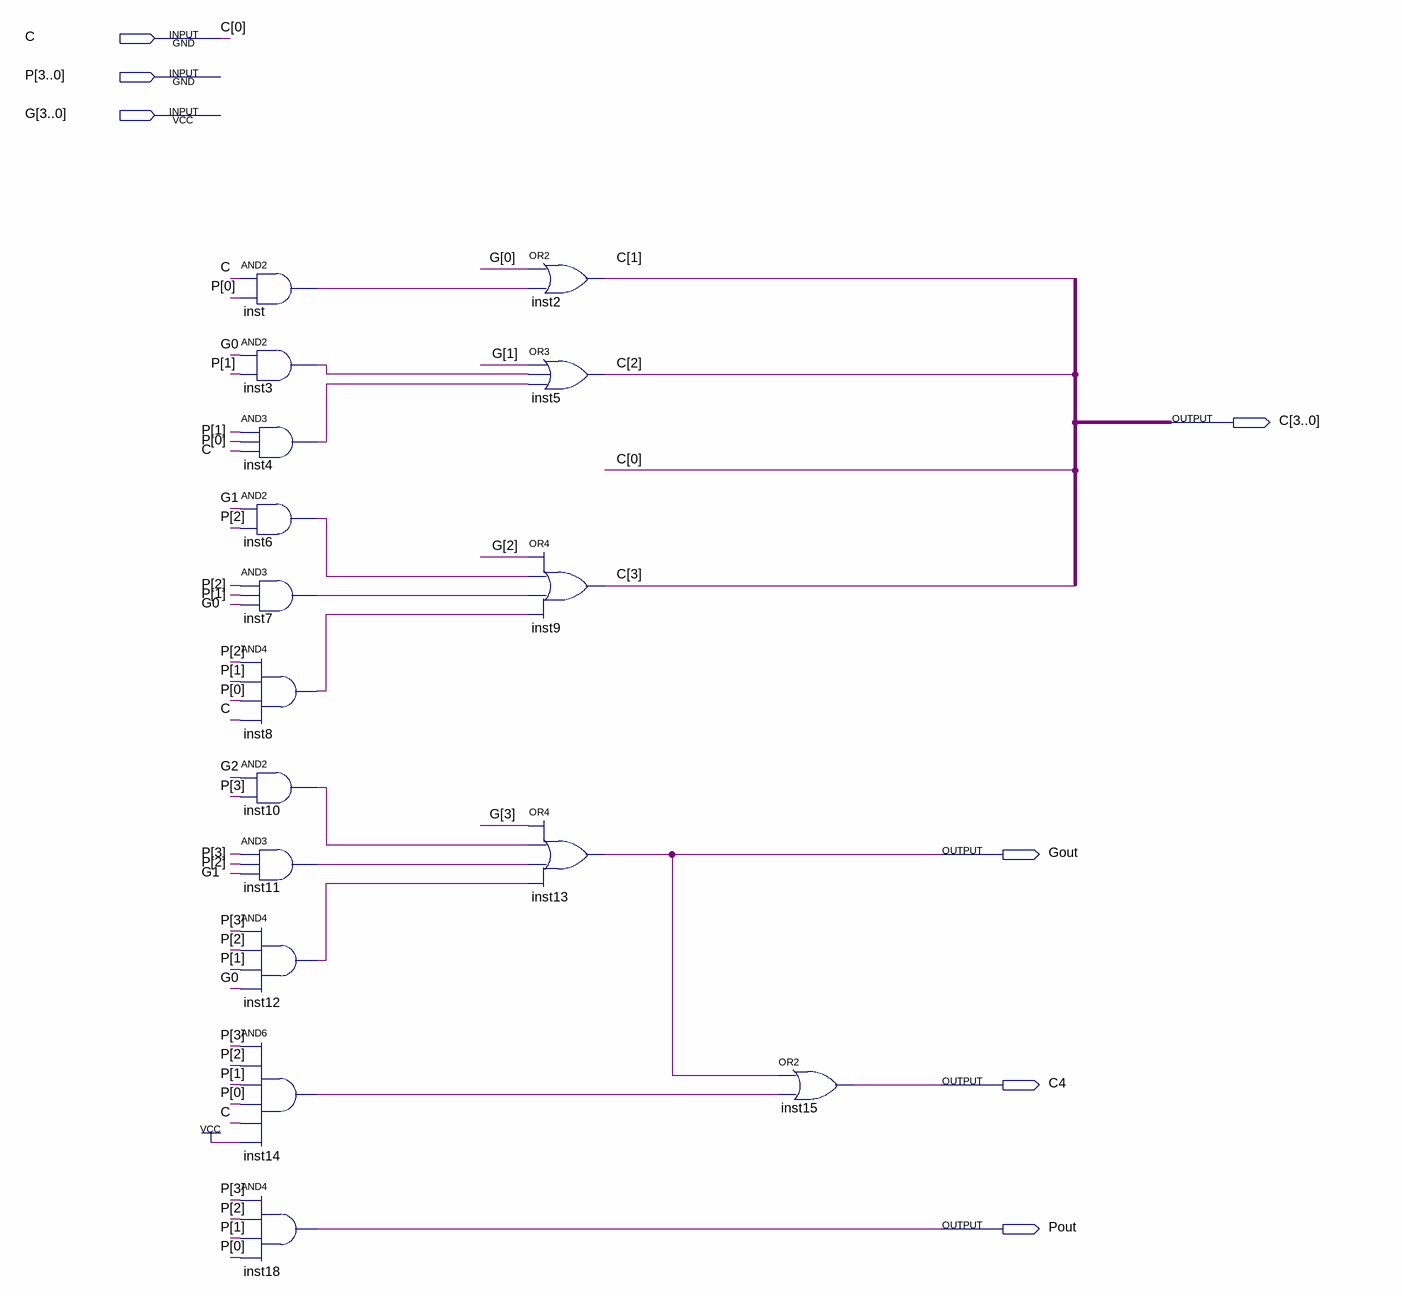
[diagram p0: schematic sheet]
// Quartus schematic cg4.bdf as structural Verilog: 16 symbols, 7 pins
module cg4 (
  input  C_1bit,
  input  [3:0] P,
  input  [3:0] G,
  output [3:0] C,
  output Gout,
  output C4,
  output Pout
);

  wire inst3_out, inst4_out, inst6_out, inst7_out, inst8_out, inst10_out, inst11_out, inst12_out, inst14_out,
       inst_out;

  and inst (inst_out, C_1bit, P[0]);
  and inst3 (inst3_out, G[0], P[1]);
  and inst4 (inst4_out, P[1], P[0], C_1bit);
  and inst6 (inst6_out, G[1], P[2]);
  and inst7 (inst7_out, P[2], P[1], G[0]);
  and inst8 (inst8_out, P[2], P[1], P[0], C_1bit);
  and inst10 (inst10_out, G[2], P[3]);
  and inst11 (inst11_out, P[3], P[2], G[1]);
  and inst12 (inst12_out, P[3], P[2], P[1], G[0]);
  and inst14 (inst14_out, P[3], P[2], P[1], P[0], C_1bit, 1'b1);
  and inst18 (Pout, P[3], P[2], P[1], P[0]);
  or inst2 (C[1], G[0], inst_out);
  or inst5 (C[2], G[1], inst3_out, inst4_out);
  or inst9 (C[3], G[2], inst6_out, inst7_out, inst8_out);
  or inst13 (Gout, G[3], inst10_out, inst11_out, inst12_out);
  or inst15 (C4, Gout, inst14_out);

  assign C[0] = C_1bit;
endmodule
